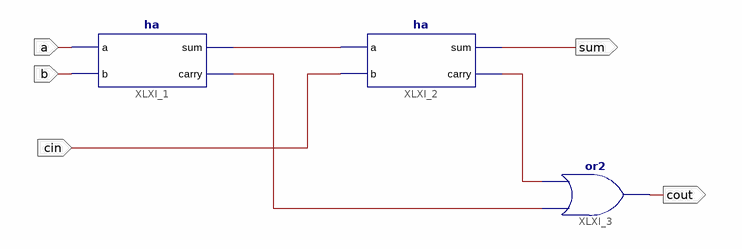
[diagram p0: schematic sheet 1]
// Xilinx ISE schematic fa.sch (xc9500) as structural Verilog: 3 symbols, 5 ports
module fa (
  input  cin,
  input  a,
  input  b,
  output sum,
  output cout
);

  wire XLXN_1, XLXN_4, XLXN_5;

  ha XLXI_1 (.a(a), .b(b), .sum(XLXN_1), .carry(XLXN_5));
  ha XLXI_2 (.a(XLXN_1), .b(cin), .sum(sum), .carry(XLXN_4));
  or XLXI_3 (cout, XLXN_5, XLXN_4);
endmodule
